# Altium schematic sheet PSU.SchDoc
size A2
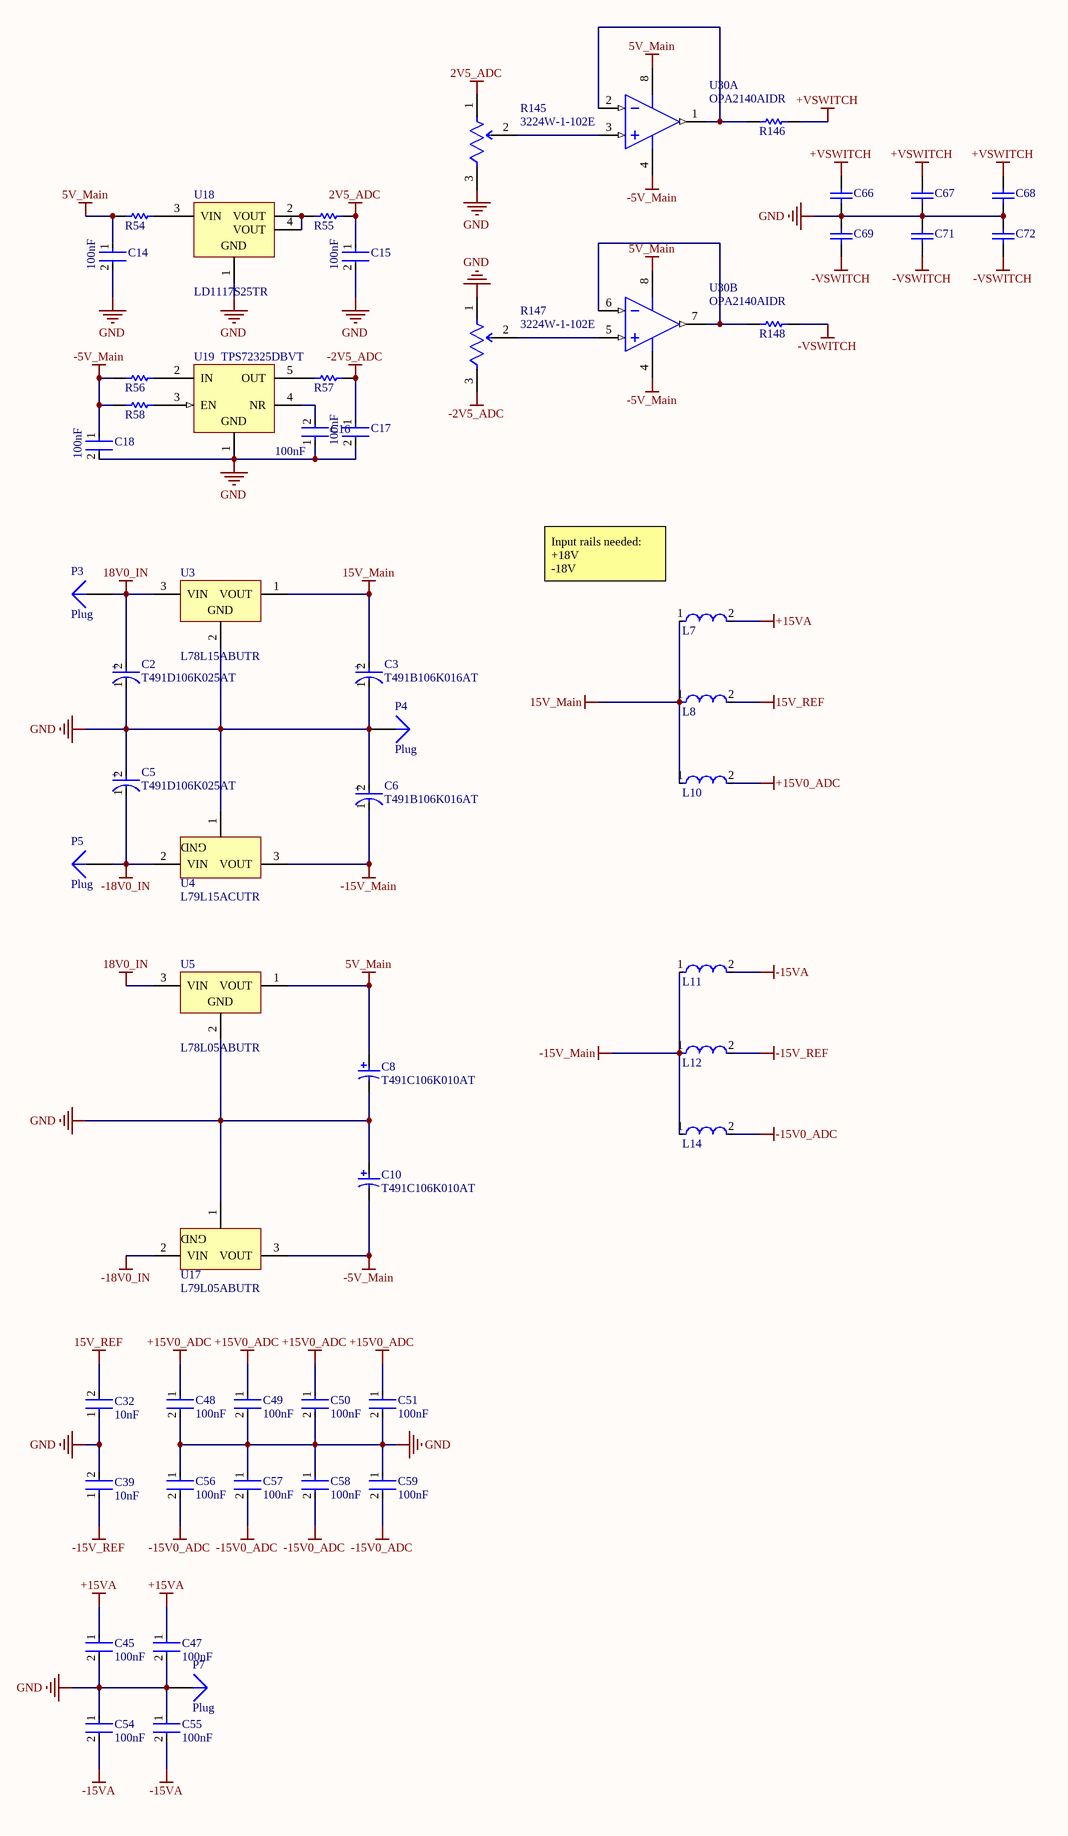
[diagram p0: PSU.SchDoc]

## Parts
C2  T491D106K025AT  [FP-T491D-MFG]
C3  T491B106K016AT  [FP-T491B106K016AT-MFG]
C5  T491D106K025AT  [FP-T491D-MFG]
C6  T491B106K016AT  [FP-T491B106K016AT-MFG]
C8  T491C106K010AT  [KEMT-T491-C_L]
C10  T491C106K010AT  [KEMT-T491-C_L]
C14  100nF  [FP-C0805C-DN-MFG]
C15  100nF  [FP-C0805C-DN-MFG]
C16  100nF  [FP-C0805C-DN-MFG]
C17  100nF  [FP-C0805C-DN-MFG]
C18  100nF  [FP-C0805C-DN-MFG]
C32  10nF  [FP-C0805C-DN-MFG]
C39  10nF  [FP-C0805C-DN-MFG]
C45  100nF  [FP-C0805C-DN-MFG]
C47  100nF  [FP-C0805C-DN-MFG]
C48  100nF  [FP-C0805C-DN-MFG]
C49  100nF  [FP-C0805C-DN-MFG]
C50  100nF  [FP-C0805C-DN-MFG]
C51  100nF  [FP-C0805C-DN-MFG]
C54  100nF  [FP-C0805C-DN-MFG]
C55  100nF  [FP-C0805C-DN-MFG]
C56  100nF  [FP-C0805C-DN-MFG]
C57  100nF  [FP-C0805C-DN-MFG]
C58  100nF  [FP-C0805C-DN-MFG]
C59  100nF  [FP-C0805C-DN-MFG]
C66  GRM188R71H103KA01D  [CAPC1608X90X35ML10T15]  (value not drawn)
C67  GRM188R71H103KA01D  [CAPC1608X90X35ML10T15]  (value not drawn)
C68  GRM188R71H103KA01D  [CAPC1608X90X35ML10T15]  (value not drawn)
C69  GRM188R71H103KA01D  [CAPC1608X90X35ML10T15]  (value not drawn)
C71  GRM188R71H103KA01D  [CAPC1608X90X35ML10T15]  (value not drawn)
C72  GRM188R71H103KA01D  [CAPC1608X90X35ML10T15]  (value not drawn)
L7  LQW15ANR10J00D  [FP-LQW15AN_00-W0_5-0_1-MFG]  (value not drawn)
L8  LQW15ANR10J00D  [FP-LQW15AN_00-W0_5-0_1-MFG]  (value not drawn)
L10  LQW15ANR10J00D  [FP-LQW15AN_00-W0_5-0_1-MFG]  (value not drawn)
L11  LQW15ANR10J00D  [FP-LQW15AN_00-W0_5-0_1-MFG]  (value not drawn)
L12  LQW15ANR10J00D  [FP-LQW15AN_00-W0_5-0_1-MFG]  (value not drawn)
L14  LQW15ANR10J00D  [FP-LQW15AN_00-W0_5-0_1-MFG]  (value not drawn)
P3  Plug  [PIN1]
P4  Plug  [PIN1]
P5  Plug  [PIN1]
P7  Plug  [PIN1]
R54  ERJ-3GEYJ202V  [RESC1608X55X30ML15T15]  (value not drawn)
R55  ERJ-3GEYJ202V  [RESC1608X55X30ML15T15]  (value not drawn)
R56  ERJ-3GEYJ202V  [RESC1608X55X30ML15T15]  (value not drawn)
R57  ERJ-3GEYJ202V  [RESC1608X55X30ML15T15]  (value not drawn)
R58  ERJ-3GEYJ202V  [RESC1608X55X30ML15T15]  (value not drawn)
R145  3224W-1-102E  [FP-3224W-MFG]
R146  ERJ-3GEYJ202V  [RESC1608X55X30ML15T15]  (value not drawn)
R147  3224W-1-102E  [FP-3224W-MFG]
R148  ERJ-3GEYJ202V  [RESC1608X55X30ML15T15]  (value not drawn)
U3  L78L15ABUTR  [SOT-89_N]
U4  L79L15ACUTR  [SOT-89_L]
U5  L78L05ABUTR  [SOT-89_L]
U17  L79L05ABUTR  [SOT-89_L]
U18  LD1117S25TR  [SOT-223_L]
U19  TPS72325DBVT  [DBV0005A_L]
U30  OPA2140AIDR  [D0008A_M]  (parts A,B of 2)

## Nets
2V5_ADC: C15.1 R55.1 R145.1(CCW)
5V_Main: C8.1 C14.1 R54.2 U5.1(VOUT) U30.8(V+)
15V_Main: C3.2(A) L7.1 L8.1 L10.1 U3.1(VOUT)
15V_REF: C32.2 L8.2
18V0_IN: C2.2(A) P3.1 U3.3(VIN) U5.3(VIN)
+15V0_ADC: C48.1 C49.1 C50.1 C51.1 L10.2
+15VA: C45.1 C47.1 L7.2
+VSWITCH: C66.2 C67.2 C68.2 R146.1
-2V5_ADC: C17.1 R57.1 R147.3(CW)
-5V_Main: C10.2 C18.1 R56.2 R58.2 U17.3(VOUT) U30.4(V-)
-15V0_ADC: C56.2 C57.2 C58.2 C59.2 L14.2
-15V_Main: C6.1(C) L11.1 L12.1 L14.1 U4.3(VOUT)
-15V_REF: C39.1 L12.2
-15VA: C54.2 C55.2 L11.2
-18V0_IN: C5.1(C) P5.1 U4.2(VIN) U17.2(VIN)
-VSWITCH: C69.1 C71.1 C72.1 R148.1
GND: C2.1(C) C3.1(C) C5.2(A) C6.2(A) C8.2 C10.1 C14.2 C15.2 C16.1 C17.2 C18.2 C32.1 C39.2 C45.2 C47.2 C48.2 C49.2 C50.2 C51.2 C54.1 C55.1 C56.1 C57.1 C58.1 C59.1 C66.1 C67.1 C68.1 C69.2 C71.2 C72.2 P4.1 P7.1 R145.3(CW) R147.1(CCW) U3.2(GND) U4.1(GND) U5.2(GND) U17.1(GND) U18.1(GND) U19.1(GND)
NetC16_2: C16.2 U19.4(NR)
NetR54_1: R54.1 U18.3(VIN)
NetR55_2: R55.2 U18.2(VOUT) U18.4(VOUT)
NetR56_1: R56.1 U19.2(IN)
NetR57_2: R57.2 U19.5(OUT)
NetR58_1: R58.1 U19.3(EN)
NetR145_2: R145.2(WIPER) U30.3(IN_A+)
NetR146_2: R146.2 U30.1(OUT_A) U30.2(IN_A-)
NetR147_2: R147.2(WIPER) U30.5(IN_B+)
NetR148_2: R148.2 U30.6(IN_B-) U30.7(OUT_B)

## Notes on the sheet
- (near L7) Input rails needed:
  +18V
  -18V
- (in symbol CMP-2000-07200-2) +
- (in symbol CMP-03017-000012-1) +

## Library data of the parts
C2 C5 = CMP-2000-07200-2: CAP TANT 10UF 10% 25V 2917; Tolerance: 20%; Life (Hours): 2000Hour; Dielectric Material: Tantalum; Dissipation Factor: 6%; Leakage Current: 2.5uA; Ripple Current: 387mA; Polarity: Polar; ESR (Equivalent Series Resistance): 1R; Voltage: 25V; Capacitance: 10uF; Voltage Rating: 25V; Voltage Rating (DC): 25V; Depth: 4.3mm; Mount: Surface Mount; Length: 7.3mm; Termination: SMD/SMT; Radiation Hardening: No; Max Operating Temperature: 125°C; REACH SVHC: No SVHC; Height: 2.8mm; Package Quantity: 1; Packaging: Tape and Reel; Case Code (Imperial): 2917; Width: 4.3mm; Min Operating Temperature: -55°C; Features: General Purpose; Case Code (Metric): 7343; Height - Seated (Max): 0.122inch; Number of Pins: 2; Lead Free: Lead Free; Case/Package: 2917
C3 C6 = CMP-03017-000012-1: CAP TANT 10UF 10% 16V 1411; Dissipation Factor: 6%; ESR (Equivalent Series Resistance): 2.8R; Ripple Current: 174mA; Dielectric Material: Tantalum; Leakage Current: 1.6uA; Polarity: Polar; Life (Hours): 2000Hour; Case/Package: 1411; Height - Seated (Max): 0.083inch; Case Code (Metric): 3528; Height: 1.9mm; Packaging: Tape and Reel; RoHS Compliant: Yes; Voltage Rating (DC): 16V; Tolerance: 10%; Lead Pitch: 1.9mm; Min Operating Temperature: -55°C; Package Quantity: 1; Capacitance: 10uF; Mount: Surface Mount; Length: 3.5mm; Max Operating Temperature: 125°C; Number of Pins: 2; Voltage: 16V; Voltage Rating: 16V; Termination: SMD/SMT; Depth: 2.8mm; Lead Free: Lead Free; REACH SVHC: No SVHC; Case Code (Imperial): 1411; Width: 0.11inch; Features: General Purpose
C8 C10 = CMP-2000-07196-1: Tantalum Surface Mount Capacitor, 10 uF, +/- 10%, 10 V, -55 to 125 degC, 2-Pin SMD, RoHS, Tape and Reel; Manufacturer: Kemet; Capacitance: 10µF; ESR: 1.8ohm; SVHC: –; Voltage Rating: 10V; Capacitor Case Style: 2312^6032Metric]; Operating Temperature Range: -55°Cto+125°C; Package Reference: T491-C; Manufacturer URL: http://www.kemet.com/; Datasheet Version: 06/2016; Package Description: 2-Pin Surface Mount Device, Body 6 x 3.2 mm; MSL: MSL1-Unlimited; Capacitance Tolerance: ±10%; Lead Spacing: –; Mounting Technology: SurfaceMount; Datasheet URL: http://www.kemet.com/Lists/ProductCatalog/Attachments/254/KEM_T2005_T491.pdf; Capacitor Terminals: SMD
C14-C18 C32 C39 C45 C47-C51 C54-C59 = CMP-2007-00279-2: CAP CER 0.1UF 50V X7R 0805; Manufacturer Part Number: C0805C104K5RACTU; Manufacturer: KEMET; Value: 0.10 μF; Tolerance: 0.1; Temperature Coefficient: 30ppm/°C; Material: Ceramic; Device Class L2: Capacitors; Temperature Range Low: -55°C; Voltage Rating: 50 V; Digikey Description: CAP CER 0.1UF 50V X7R 0805; Category: Cap; ComponentLink2Description: Datasheet; Octopart: https://octopart.com/c0805c104k5ractu-kemet-143926; RoHS: TRUE; ComponentLink2URL: https://content.kemet.com/datasheets/KEM_C1003_C0G_SMD.pdf; Temperature Characteristic: X7R; Temperature: -55°C to +125°C; Height: 0.88mm; Temperature Range High: +125°C; Device Class L1: Passive Components; Automotive: No; Lead Free: Yes; Ipc Land Pattern Name: CAPC200125X78; Device Class L3: Ceramic Capacitors; Mouser Description: Cap Ceramic 0.1uF 50V X7R 10% SMD 2.0 x 1.2 mm 125 C Paper T/R; Capacitance: 0.10 μF; Package: C0805C-DN
C66-C69 C71 C72 = CMP-2100-03642-1: Chip Capacitor, 10 nF, +/- 10%, 50 V, -55 to 125 degC, 0603 (1608 Metric), RoHS, Tape and Reel; Manufacturer: Murata; Insulation Resistance: 10GR; Dielectric: X7R; Voltage Rating: 50V; Capacitance: 10nF; Material: Ceramic; Package Quantity: 1; Lead Free: LeadFree; Case/Package: 0603; Termination: SMD/SMT; REACH SVHC: Unknown; Manufacturer URL: http://www.murata.com/; Datasheet URL: http://search.murata.co.jp/Ceramy/image/img/A01X/G101/ENG/GRM188R71H103KA01-01.pdf; Mount: SurfaceMount; Datasheet Version: 42401.0; Number of Pins: 2; Length: 1.6mm; Voltage: 50V; Depth: 0.8mm; Tolerance: 10%; Min Operating Temperature: -55degC; Voltage Rating (DC): 50V; Max Operating Temperature: 125degC; Package Description: 2-Pin Surface Mount Device, Body 1.6 x 0.8 mm; RoHSCompliant: True; Case Code (Imperial): 0603; Width: 0.031inch; Case Code (Metric): 1608; Height: 0.8mm; Package Reference: 0603; Packaging: TapeandReel; Thickness: 0.035inch; Dielectric Material: Ceramic
L7 L8 L10-L12 L14 = CMP-06042-005024-1: Wire Wound RF Inductor 100nH ±5% 120mA 2.52Ω 0402 (1005); DC Resistance (DCR): 2.52R; Core Material: Air; Test Frequency: 100MHz; Self Resonant Frequency: 1.5GHz; Shielding: Unshielded; Length: 1mm; Radiation Hardening: No; REACH SVHC: No SVHC; Case Code (Metric): 1005; Inductance Tolerance: 5%; Weight: 2.8E-05oz; Case/Package: 0402; Mount: Surface Mount; Number of Pins: 2; Height: 0.5mm; Max DC Current: 120mA; Max Operating Temperature: 125°C; Termination: SMD/SMT; Min Operating Temperature: -55°C; DC Current: 120mA; Depth: 0.6mm; Current Rating: 120mA; Tolerance: 5%; Inductance: 100nH; Package Quantity: 10000; Lead Free: Lead Free; Case Code (Imperial): 0402; Packaging: Tape and Reel; Width: 0.5mm; Military Standard: Not
R54-R58 R146 R148 = CMP-2000-00741-1: Manufacturer: Panasonic; Part Number: ERJ-3GEYJ202V
R145 R147 = CMP-07234-000003-1: TRIMMER 1K OHM 0.25W J LEAD TOP; Manufacturer: Bourns; Resistance: 1kΩ; Tolerance: 10%; Voltage Rating: 300V; Standoff Height: 0.2mm; Temperature Coefficient: 100ppm/°C; Value: 1kΩ; Lead Free: Yes; Temperature Range High: +150°C; ComponentLink2URL: https://www.bourns.com/docs/Product-Datasheets/3224.pdf; Height: 5.55mm; Device Class L3: Variable Resistors and Potentiometers; Mouser Description: Trimmer Resistors - SMD 4mm 1Kohms 10% Square Cermet Sealed; Series: 3224; Automotive: No; Octopart: https://octopart.com/3224w-1-102e-bourns-23105; Package: 3224W; Device Class L1: Passive Components; Temperature Range Low: -65°C; Manufacturer Part Number: 3224W-1-102E; Power Rating: 0.25W; Digikey Description: TRIMMER 1K OHM 0.25W J LEAD TOP; RoHS: TRUE; Category: Res; ComponentLink2Description: Datasheet; Temperature: -65°C to +150°C; Composition: Cermet; Device Class L2: Resistors
U3 = CMP-0244-00386-1: Positive Voltage Regulator, 15V, 4-Pin SOT-89, Tape and Reel; PackageDescription: 3-Pin SOT-89 Package 1.5 mm Pitch, 4.1 mm Lead Span; ComponentLink2URL: http://www.st.com/internet/com/TECHNICAL_RESOURCES/TECHNICAL_LITERATURE/DATASHEET/CD00000446.pdf; ComponentLink1Description: Manufacturer URL; PackageReference: SOT-89; ComponentLink1URL: http://www.st.com; ComponentLink2Description: Datasheet; PackageVersion: 2011; DatasheetVersion: 1/02/2011
U4 = CMP-0244-00408-1: Negative Voltage Regulator, -15V, 4-Pin SOT-89, Tape and Reel; ComponentLink2URL: http://www.st.com/internet/com/TECHNICAL_RESOURCES/TECHNICAL_LITERATURE/DATASHEET/CD00000539.pdf; PackageVersion: 2011; DatasheetVersion: 1/07/2009; ComponentLink1URL: http://www.st.com; ComponentLink2Description: Datasheet; PackageDescription: 3-Pin SOT-89 Package 1.5 mm Pitch, 4.1 mm Lead Span; PackageReference: SOT-89; ComponentLink1Description: Manufacturer URL
U5 = CMP-0244-00406-1: Positive Voltage Regulator, 5V, 4-Pin SOT-89, Tape and Reel; PackageVersion: 2011; DatasheetVersion: 1/02/2011; PackageDescription: 3-Pin SOT-89 Package 1.5 mm Pitch, 4.1 mm Lead Span; PackageReference: SOT-89; ComponentLink2Description: Datasheet; ComponentLink1URL: http://www.st.com; ComponentLink1Description: Manufacturer URL; ComponentLink2URL: http://www.st.com/internet/com/TECHNICAL_RESOURCES/TECHNICAL_LITERATURE/DATASHEET/CD00000446.pdf
U17 = CMP-0244-00397-1: Negative Voltage Regulator, -5V, 4-Pin SOT-89, Tape and Reel; DatasheetVersion: 1/07/2009; PackageVersion: 2011; ComponentLink2Description: Datasheet; ComponentLink1Description: Manufacturer URL; PackageDescription: 3-Pin SOT-89 Package 1.5 mm Pitch, 4.1 mm Lead Span; PackageReference: SOT-89; ComponentLink2URL: http://www.st.com/internet/com/TECHNICAL_RESOURCES/TECHNICAL_LITERATURE/DATASHEET/CD00000539.pdf; ComponentLink1URL: http://www.st.com
U18 = CMP-0244-00306-1: Fixed Low Drop Positive Voltage Regulator, 4-Pin SOT-223, Tape and Reel; ComponentLink2URL: http://www.st.com/internet/com/TECHNICAL_RESOURCES/TECHNICAL_LITERATURE/DATASHEET/CD00000544.pdf; ComponentLink1URL: http://www.st.com; PackageVersion: 2010; DatasheetVersion: 1/11/2011; PackageDescription: 4-Pin SOT-223 Package, 6.5 x 3.5 mm Body, 2.3 mm Pitch, 7 mm Lead Span; ComponentLink1Description: Manufacturer URL; PackageReference: SOT-223; ComponentLink2Description: Datasheet
U19 = CMP-0394-00284-2: Single Output High PSRR LDO, 200 mA, Fixed -2.5 V Output, -10 to -2.7 V Input, 5-pin SOT-23 (DBV), -40 to 125 degC, Green (RoHS & no Sb/Br); Manufacturer: Texas Instruments; SubFamily: Single Channel LDO; Vdo(Typ)(mV): 280; Iout(Max)(A): 0.2; Iq(Typ)(mA): 0.13; Accuracy(%): 2; PackageReference: DBV0005A; ComponentLink3Description: Package Specification; Code_JEDEC: MO-178; ComponentLink2Description: Datasheet; Eco-Plan: Green (RoHS & no Sb/Br); PackageVersion: 4073253-4/K; Vout Adj(Max)(V): -2.5; Fixed Output Options(V): -2.5; Vout Adj(Min)(V): -2.5; PackageDescription: 5-Pin Plastic Small Outline, Body 1.60 Ãƒâ€” 2.90 mm, Pitch 0.95 mm; ComponentLink3URL: http://www.ti.com/litv/pdf/mpds018i; PartNumber: TPS72325DBVT; Vin(Max)(V): -2.7; ComponentLink1Description: Manufacturer URL; ComponentLink2URL: http://www.ti.com/general/docs/lit/getliterature.tsp?genericPartNumber=TPS72325&fileType=pdf; Mounting Technology: Surface Mount; DatasheetVersion: SLVS346B; Vin(Min)(V): -10; ComponentLink1URL: http://www.ti.com/
U30 = CMP-0272-00256-3: 11 MHz, Precision, Low Noise, Rail-to-Rail Output, JFET Operational Amplifier, 4.5 to 36 V, -40 to 125 degC, 8-pin SOIC (D8), Green (RoHS & no Sb/Br); Manufacturer: Texas Instruments; Number of Channels: 2; Total Supply Voltage(Min)(+5V is 5, +/-5V is 10): 4.5; Vio (25C)(Max)(mV): 0.12; Total Supply Voltage(Max)(+5V is 5, +/-5V is 10): 36; Offset Drift(Typ)(uV/C): 0.35; IIB(Max)(pA): 10; GBW(Typ)(MHz): 11; Slew Rate(Typ)(V/us): 20; Packing: LARGE T&R; Sub Family: High Supply Voltage Amplifier (>=30V), Low Input Bias Current Amp (<=10pA), Low Noise Amp (<=10nV/rtHz), Low Offset Voltage Amplifier (<=500uV), Precision Amplifier; CMRR(Min)(dB): 126; Rating: Catalog; PackageReference: D0008A; ComponentLink2URL: http://www.ti.com/lit/ds/symlink/opa2140.pdf; ComponentLink1Description: Manufacturer URL; Iq per channel(Max)(mA): 2; Code_JEDEC: MS-012; PartNumber: OPA2140AIDR; Eco-Plan: Green (RoHS & no Sb/Br); ComponentLink3URL: http://www.ti.com/litv/pdf/msoi002j; ComponentLink3Description: Package Specification; ComponentLink1URL: http://www.ti.com/; DatasheetVersion: SBOS498A; PackageVersion: 4040047-3/M, 06/2011; Mounting Technology: Surface Mount; ComponentLink2Description: Datasheet; PackageDescription: 8-Pin Plastic Small Outline, Body 4.9 x 3.9 mm, Pitch 1.27 mm
P3-P5 P7 = Plug: LatestRevisionDate: 17-Jul-2002; LatestRevisionNote: Re-released for DXP Platform.; Publisher: Altium Limited